# EAGLE schematic teensy perf schematic_2 (EAGLE 7.6.0)
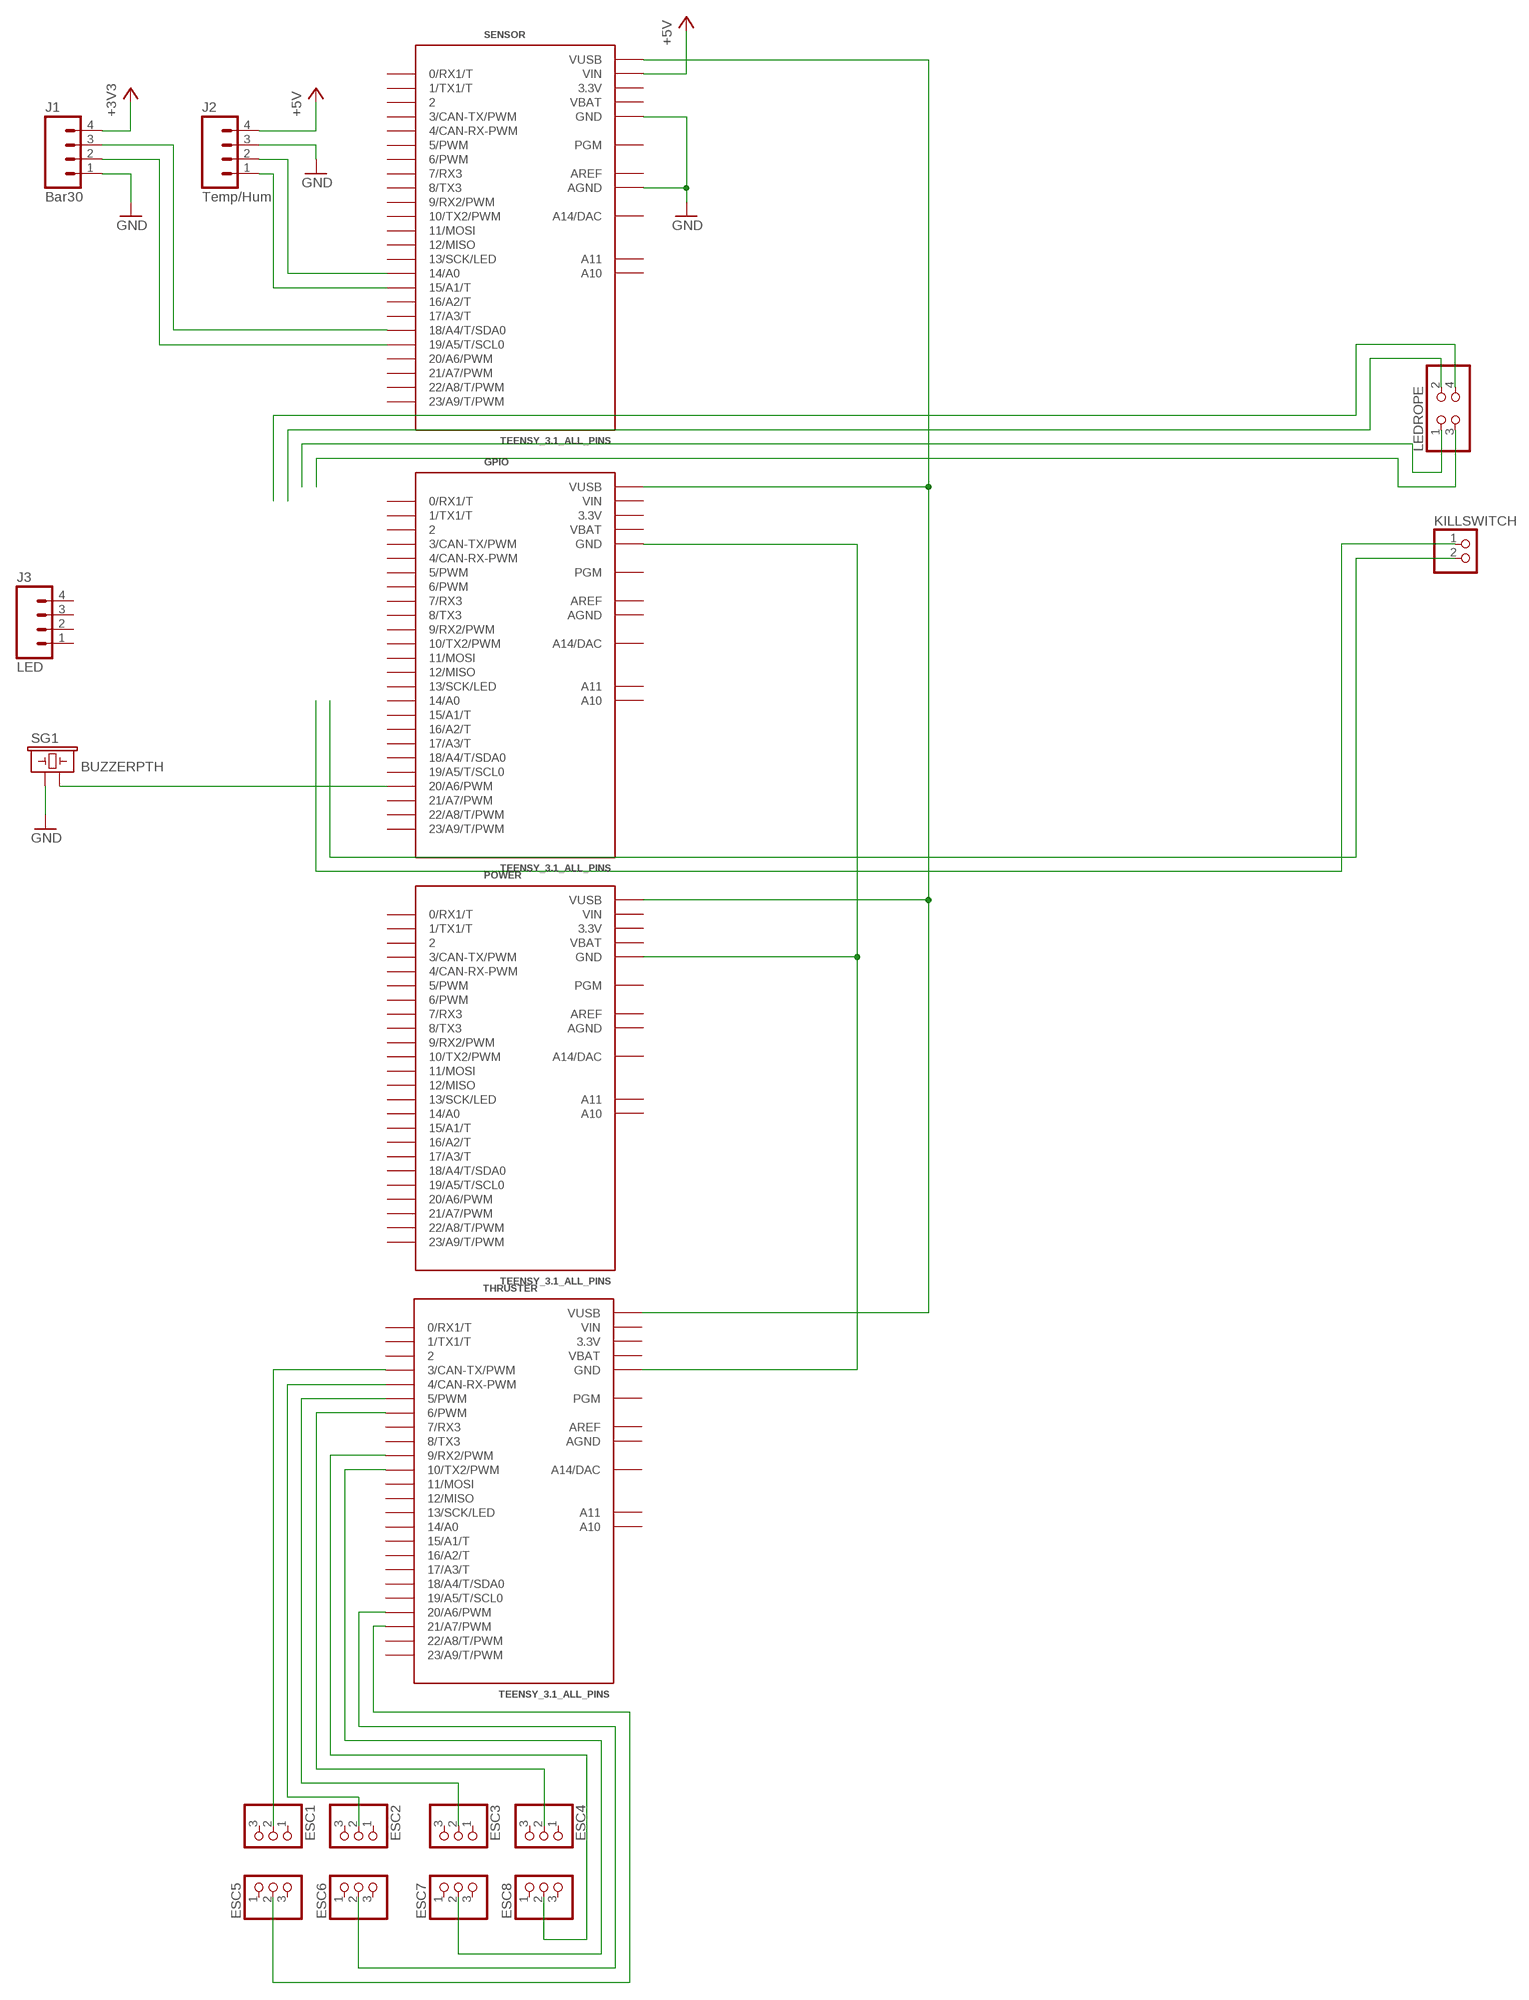
[diagram p0: schematic, sheet 1]

## Parts
ESC1  PINHD-1X3  [1X03]
ESC2  PINHD-1X3  [1X03]
ESC3  PINHD-1X3  [1X03]
ESC4  PINHD-1X3  [1X03]
ESC5  PINHD-1X3  [1X03]
ESC6  PINHD-1X3  [1X03]
ESC7  PINHD-1X3  [1X03]
ESC8  PINHD-1X3  [1X03]
GPIO  TEENSY_3.1_ALL_PINS  [TEENSY3-ALL_PINS]
J1  Bar30  M04PTH  [1X04]
J2  Temp/Hum  M04PTH  [1X04]
J3  LED  M04PTH  [1X04]
KILLSWITCH  PINHD-1X2  [1X02]
LEDROPE  PINHD-2X2  [2X02]
POWER  TEENSY_3.1_ALL_PINS  [TEENSY3-ALL_PINS]
SENSOR  TEENSY_3.1_ALL_PINS  [TEENSY3-ALL_PINS]
SG1  BUZZERPTH  [BUZZER-12MM]
THRUSTER  TEENSY_3.1_ALL_PINS  [TEENSY3-ALL_PINS]

## Nets
+3V3: J1.4
+5V: J2.4 SENSOR.VIN
GND: J1.1 J2.3 SENSOR.AGND SENSOR.GND SENSOR.GND1(GND) SG1.+
N$1: J1.2 SENSOR.19/A5(19/A5/T/SCL0)
N$2: ESC1.2 THRUSTER.3(3/CAN-TX/PWM)
N$3: ESC2.2 THRUSTER.4(4/CAN-RX-PWM)
N$4: ESC3.2 THRUSTER.5(5/PWM)
N$5: ESC4.2 THRUSTER.6(6/PWM)
N$6: ESC8.2 THRUSTER.9(9/RX2/PWM)
N$7: ESC7.2 THRUSTER.10(10/TX2/PWM)
N$8: ESC6.2 THRUSTER.20/A6(20/A6/PWM)
N$9: THRUSTER.21/A7(21/A7/PWM)
N$10: J1.3 SENSOR.18/A4(18/A4/T/SDA0)
N$11: J2.1 SENSOR.15/A1(15/A1/T)
N$12: GPIO.GND GPIO.GND1(GND) POWER.GND POWER.GND1(GND) THRUSTER.GND THRUSTER.GND1(GND)
N$13: GPIO.20/A6(20/A6/PWM) SG1.-
N$14: LEDROPE.4
N$15: LEDROPE.2
N$16: LEDROPE.1
N$17: LEDROPE.3
N$18: KILLSWITCH.1
N$19: KILLSWITCH.2
N$20: GPIO.VUSB POWER.VUSB SENSOR.VUSB THRUSTER.VUSB
N$21: J2.2 SENSOR.14/A0
Unconnected: ESC1.1 ESC1.3 ESC2.1 ESC2.3 ESC3.1 ESC3.3 ESC4.1 ESC4.3 ESC5.1 ESC5.2 ESC5.3 ESC6.1 ESC6.3 ESC7.1 ESC7.3 ESC8.1 ESC8.3 GPIO.0(0/RX1/T) GPIO.1(1/TX1/T) GPIO.2 GPIO.3(3/CAN-TX/PWM) GPIO.4(4/CAN-RX-PWM) GPIO.5(5/PWM) GPIO.6(6/PWM) GPIO.7(7/RX3) GPIO.8(8/TX3) GPIO.9(9/RX2/PWM) GPIO.10(10/TX2/PWM) GPIO.11(11/MOSI) GPIO.12(12/MISO) GPIO.13(13/SCK/LED) GPIO.14/A0 GPIO.15/A1(15/A1/T) GPIO.16/A2(16/A2/T) GPIO.17/A3(17/A3/T) GPIO.18/A4(18/A4/T/SDA0) GPIO.19/A5(19/A5/T/SCL0) GPIO.21/A7(21/A7/PWM) GPIO.22/A8(22/A8/T/PWM) GPIO.23/A9(23/A9/T/PWM) GPIO.A10 GPIO.A11 GPIO.PGM GPIO.RESET/DAC(A14/DAC) J3.1 J3.2 J3.3 J3.4 POWER.0(0/RX1/T) POWER.1(1/TX1/T) POWER.2 POWER.3(3/CAN-TX/PWM) POWER.4(4/CAN-RX-PWM) POWER.5(5/PWM) POWER.6(6/PWM) POWER.7(7/RX3) POWER.8(8/TX3) POWER.9(9/RX2/PWM) POWER.10(10/TX2/PWM) POWER.11(11/MOSI) POWER.12(12/MISO) POWER.13(13/SCK/LED) POWER.14/A0 POWER.15/A1(15/A1/T) POWER.16/A2(16/A2/T) POWER.17/A3(17/A3/T) POWER.18/A4(18/A4/T/SDA0) POWER.19/A5(19/A5/T/SCL0) POWER.20/A6(20/A6/PWM) POWER.21/A7(21/A7/PWM) POWER.22/A8(22/A8/T/PWM) POWER.23/A9(23/A9/T/PWM) POWER.A10 POWER.A11 POWER.PGM POWER.RESET/DAC(A14/DAC) SENSOR.0(0/RX1/T) SENSOR.1(1/TX1/T) SENSOR.2 SENSOR.3(3/CAN-TX/PWM) SENSOR.4(4/CAN-RX-PWM) SENSOR.5(5/PWM) SENSOR.6(6/PWM) SENSOR.7(7/RX3) SENSOR.8(8/TX3) SENSOR.9(9/RX2/PWM) SENSOR.10(10/TX2/PWM) SENSOR.11(11/MOSI) SENSOR.12(12/MISO) SENSOR.13(13/SCK/LED) SENSOR.16/A2(16/A2/T) SENSOR.17/A3(17/A3/T) SENSOR.20/A6(20/A6/PWM) SENSOR.21/A7(21/A7/PWM) SENSOR.22/A8(22/A8/T/PWM) SENSOR.23/A9(23/A9/T/PWM) SENSOR.A10 SENSOR.A11 SENSOR.PGM SENSOR.RESET/DAC(A14/DAC) THRUSTER.0(0/RX1/T) THRUSTER.1(1/TX1/T) THRUSTER.2 THRUSTER.7(7/RX3) THRUSTER.8(8/TX3) THRUSTER.11(11/MOSI) THRUSTER.12(12/MISO) THRUSTER.13(13/SCK/LED) THRUSTER.14/A0 THRUSTER.15/A1(15/A1/T) THRUSTER.16/A2(16/A2/T) THRUSTER.17/A3(17/A3/T) THRUSTER.18/A4(18/A4/T/SDA0) THRUSTER.19/A5(19/A5/T/SCL0) THRUSTER.22/A8(22/A8/T/PWM) THRUSTER.23/A9(23/A9/T/PWM) THRUSTER.A10 THRUSTER.A11 THRUSTER.PGM THRUSTER.RESET/DAC(A14/DAC)

## Power pins joined to a net without a drawn wire
3.3V: GPIO.3.3V GPIO.3.3V1(3.3V) POWER.3.3V POWER.3.3V1(3.3V) SENSOR.3.3V SENSOR.3.3V1(3.3V) THRUSTER.3.3V THRUSTER.3.3V1(3.3V)
AGND: GPIO.AGND POWER.AGND THRUSTER.AGND
AREF: GPIO.AREF POWER.AREF SENSOR.AREF THRUSTER.AREF
VBAT: GPIO.VBAT POWER.VBAT SENSOR.VBAT THRUSTER.VBAT
VIN: GPIO.VIN POWER.VIN THRUSTER.VIN

## Library data of the parts
ESC1-ESC8 = pinhead:PINHD-1X3: PIN HEADER
GPIO POWER SENSOR THRUSTER = Teensy_3_and_LC_Series_Boards_v1.1:TEENSY_3.1_ALL_PINS: Footprint for Teensy 3.1 or 3.2 board using all through-holes, i.e. the entire perimeter plus the 4 through-holes inboard (A10,A11,AREF, VUSB)
J1-J3 = SparkFun-Connectors:M04: Header 4 Standard 4-pin 0.1" header. Use with straight break away headers (SKU : PRT-00116), right angle break away headers (PRT-00553), swiss pins (PRT-00743), machine pins (PRT-00117), and female headers (PRT-00115). Molex polarized connector foot print use with SKU : PRT-08231 with associated crimp pins and housings. 1MM SMD Version SKU: PRT-10208; PROD_ID: CONN-09696
KILLSWITCH = pinhead:PINHD-1X2: PIN HEADER
LEDROPE = pinhead:PINHD-2X2: PIN HEADER
SG1 = SparkFun-Electromechanical:BUZZER: Buzzer 12mm Spark Fun Electronics SKU : Comp-Buzzer